# Altium schematic sheet УШЯИ.687245.044Э3_1.SchDoc
size 420 x 297 mm; SheetNumber: 1; SheetTotal: 2
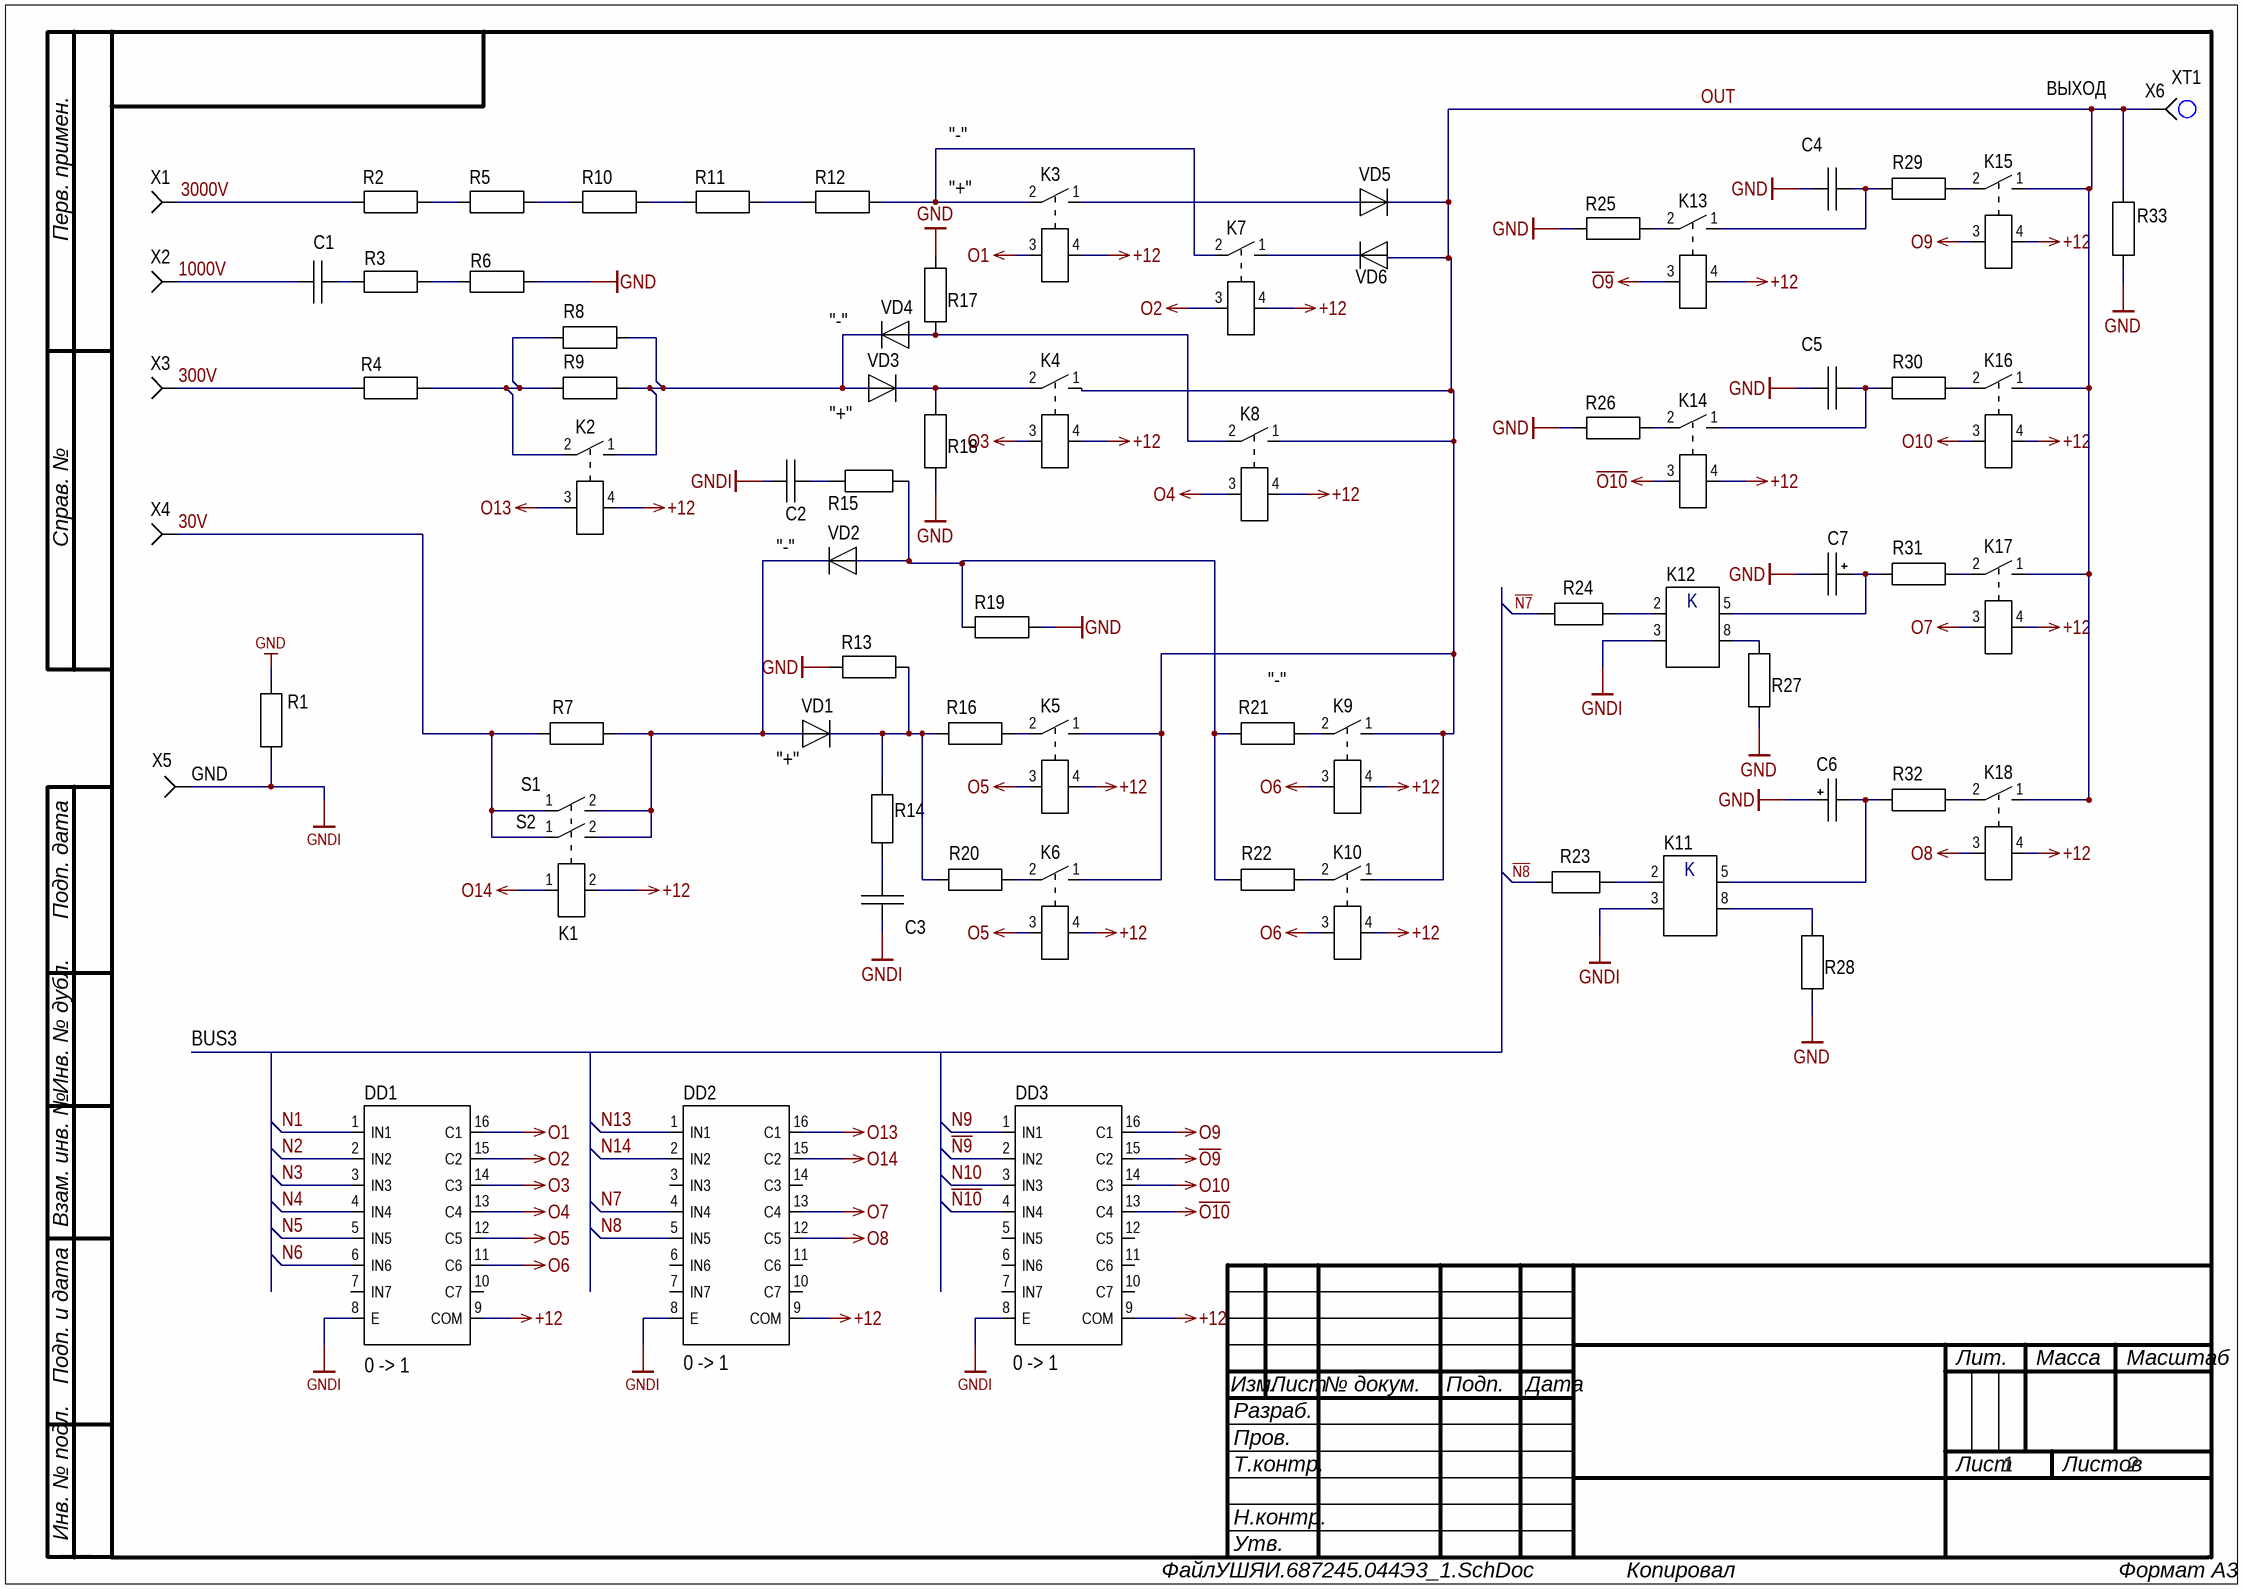
[diagram p0: УШЯИ.687245.044Э3_1.SchDoc]

## Parts
C1  К73-14М-4 кВ-0,033 мкФ +-10%  [К73-14М-4 кВ-D18]  (value not drawn)
C2  К73-17-250 В-0,47 мкФ +-20%  [К73-17-А20]  (value not drawn)
C3  К73-17-250 В-0,47 мкФ +-20%  [К73-17-А20]  (value not drawn)
C4  К73-14М-4 кВ-0,1 мкФ +-10%  [К73-14М-4 кВ-D28]  (value not drawn)
C5  К73-14М-4 кВ-0,1 мкФ +-10%  [К73-14М-4 кВ-D28]  (value not drawn)
C6  LGG2G331MELB30  [CAP TH ALUM ELEC D30.00mm S10.00mm H30.00mm]  (value not drawn)
C7  LGG2G331MELB30  [CAP TH ALUM ELEC D30.00mm S10.00mm H30.00mm]  (value not drawn)
DD1  ULQ2003AD  [16-SOIC]  (value not drawn)
DD2  ULQ2003AD  [16-SOIC]  (value not drawn)
DD3  ULQ2003AD  [16-SOIC]  (value not drawn)
K1  УШЯИ.685442.092vs2Rel  [УШЯИ.685442.092vs2Rel]  (value not drawn)
K2  DAR71210TU  [DAR71210TU]  (value not drawn)
K3  DAR71210TU  [DAR71210TU]  (value not drawn)
K4  DAR71210TU  [DAR71210TU]  (value not drawn)
K5  DAR71210TU  [DAR71210TU]  (value not drawn)
K6  DAR71210TU  [DAR71210TU]  (value not drawn)
K7  DAR71210TU  [DAR71210TU]  (value not drawn)
K8  DAR71210TU  [DAR71210TU]  (value not drawn)
K9  DAR71210TU  [DAR71210TU]  (value not drawn)
K10  DAR71210TU  [DAR71210TU]  (value not drawn)
K11  TLP3549F  [8-DIP]  (value not drawn)
K12  TLP3549F  [8-DIP]  (value not drawn)
K13  DAR71210TU  [DAR71210TU]  (value not drawn)
K14  DAR71210TU  [DAR71210TU]  (value not drawn)
K15  DAR71210TU  [DAR71210TU]  (value not drawn)
K16  DAR71210TU  [DAR71210TU]  (value not drawn)
K17  DAR71210TU  [DAR71210TU]  (value not drawn)
K18  DAR71210TU  [DAR71210TU]  (value not drawn)
R1  С2-33Н-0,5-270 Ом +-5%  [С2-33Н-0,5АИ (140.02.0203.00.00)]  (value not drawn)
R2  С2-33-2-1,2 кОм +-5%  [С2-33-2-NC]  (value not drawn)
R3  С2-33Н-1-10 кОм +-5%  [С2-33Н-1АИ (140.02.0204.00.00)]  (value not drawn)
R4  С2-33Н-1-15 Ом +-5%  [С2-33Н-1АИ-1PIN]  (value not drawn)
R5  С2-33-2-1,2 кОм +-5%  [С2-33-2-NC]  (value not drawn)
R6  С2-33Н-1-10 кОм +-5%  [С2-33Н-1АИ (140.02.0204.00.00)]  (value not drawn)
R7  С2-33-2-15 Ом +-5%  [С2-33-2-1PIN]  (value not drawn)
R8  С2-33-2-300 Ом +-5%  [С2-33-2 (140.02.0206.00.00)]  (value not drawn)
R9  С2-33-2-300 Ом +-5%  [С2-33-2 (140.02.0206.00.00)]  (value not drawn)
R10  С2-33-2-1,2 кОм +-5%  [С2-33-2-NC]  (value not drawn)
R11  С2-33-2-1,2 кОм +-5%  [С2-33-2-NC]  (value not drawn)
R12  С2-33-2-1,2 кОм +-5%  [С2-33-2-NC]  (value not drawn)
R13  С2-33-2-15 кОм +-5%  [С2-33-2-2PIN]  (value not drawn)
R14  1206-10 Ом+-5%  [1206]  (value not drawn)
R15  1206-10 Ом+-5%  [1206]  (value not drawn)
R16  С2-33Н-0,5-3 Ом +-5%  [С2-33Н-0,5АИ-1PIN]  (value not drawn)
R17  С2-33-2-470 кОм +-5%  [С2-33-2-1PIN]  (value not drawn)
R18  С2-33-2-470 кОм +-5%  [С2-33-2-1PIN]  (value not drawn)
R19  С2-33-2-15 кОм +-5%  [С2-33-2-2PIN]  (value not drawn)
R20  С2-33Н-0,5-3 Ом +-5%  [С2-33Н-0,5АИ-1PIN]  (value not drawn)
R21  С2-33Н-0,5-3 Ом +-5%  [С2-33Н-0,5АИ-1PIN]  (value not drawn)
R22  С2-33Н-0,5-3 Ом +-5%  [С2-33Н-0,5АИ-1PIN]  (value not drawn)
R23  1206-470 Ом+-5%  [1206]  (value not drawn)
R24  1206-470 Ом+-5%  [1206]  (value not drawn)
R25  С2-33Н-1-1 МОм +-5%  [С2-33Н-1АИ-1PIN]  (value not drawn)
R26  С2-33Н-1-1 МОм +-5%  [С2-33Н-1АИ-1PIN]  (value not drawn)
R27  С2-33-2-1,2 кОм +-5%  [С2-33-2-2PIN]  (value not drawn)
R28  С2-33-2-1,2 кОм +-5%  [С2-33-2-2PIN]  (value not drawn)
R29  С2-33-2-3,3 кОм +-5%  [С2-33-2-1PIN]  (value not drawn)
R30  С2-33-2-3,3 кОм +-5%  [С2-33-2-1PIN]  (value not drawn)
R31  С2-33Н-1-1 кОм +-5%  [С2-33Н-1АИ-1PIN]  (value not drawn)
R32  С2-33Н-1-1 кОм +-5%  [С2-33Н-1АИ-1PIN]  (value not drawn)
R33  Р1-32-1-18 МОм +-5%  [R1-32-1_(140.0210)]  (value not drawn)
S1  МКА-50202  (value not drawn)
S2  МКА-50202  (value not drawn)
VD1  20ETF08/IR  [TO-220]  (value not drawn)
VD2  20ETF08/IR  [TO-220]  (value not drawn)
VD3  BY255/Taw  [DO-201-NC]  (value not drawn)
VD4  BY255/Taw  [DO-201-NC]  (value not drawn)
VD5  HVM8  [HVM8]  (value not drawn)
VD6  HVM8  [HVM8]  (value not drawn)
X1  TR-1,25-4  (value not drawn)
X2  TR-1,25-4  (value not drawn)
X3  TR-1,25-4  (value not drawn)
X4  TR-1,25-4  (value not drawn)
X5  TR-1,25-4  (value not drawn)
X6  TR-1,25-4  (value not drawn)
XT1  УШЯИ.685631.123  (value not drawn)

## Nets
+12: DD1.9(COM) DD2.9(COM) DD3.9(COM) K1.2(COIL_2) K2.4(COIL_1) K3.4(COIL_1) K4.4(COIL_1) K5.4(COIL_1) K6.4(COIL_1) K7.4(COIL_1) K8.4(COIL_1) K9.4(COIL_1) K10.4(COIL_1) K13.4(COIL_1) K14.4(COIL_1) K15.4(COIL_1) K16.4(COIL_1) K17.4(COIL_1) K18.4(COIL_1)
~{O9}: DD3.15(C2) K13.3(COIL_2)
~{O10}: DD3.13(C4) K14.3(COIL_2)
GND: C4.1 C5.1 C6.1 C7.2 R1.2 R6.2 R13.1 R17.1 R18.1 R19.2 R25.1 R26.1 R27.2 R28.2 R33.1
GNDI: C2.2 C3.2 DD1.8(E) DD2.8(E) DD3.8(E) K11.3(KATHODE) K12.3(KATHODE) R1.1 X5.1
O1: DD1.16(C1) K3.3(COIL_2)
O2: DD1.15(C2) K7.3(COIL_2)
O3: DD1.14(C3) K4.3(COIL_2)
O4: DD1.13(C4) K8.3(COIL_2)
O5: DD1.12(C5) K5.3(COIL_2) K6.3(COIL_2)
O6: DD1.11(C6) K9.3(COIL_2) K10.3(COIL_2)
O7: DD2.13(C4) K17.3(COIL_2)
O8: DD2.12(C5) K18.3(COIL_2)
O9: DD3.16(C1) K15.3(COIL_2)
O10: DD3.14(C3) K16.3(COIL_2)
O13: DD2.16(C1) K2.3(COIL_2)
O14: DD2.15(C2) K1.1(COIL_1)
30V: R7.1 S1.1(NO) S2.1(NO) X4.1
300V: R4.1 X3.1
1000V: C1.1 X2.1
3000V: R2.1 X1.1
~{N7}: R24.1
~{N8}: R23.1
~{N9}: DD3.2(IN2)
~{N10}: DD3.4(IN4)
N1: DD1.1(IN1)
N2: DD1.2(IN2)
N3: DD1.3(IN3)
N4: DD1.4(IN4)
N5: DD1.5(IN5)
N6: DD1.6(IN6)
N7: DD2.4(IN4)
N8: DD2.5(IN5)
N9: DD3.1(IN1)
N10: DD3.3(IN3)
N13: DD2.1(IN1)
N14: DD2.2(IN2)
OUT: K4.1(COM) K5.1(COM) K6.1(COM) K8.1(COM) K9.1(COM) K10.1(COM) K15.1(COM) K16.1(COM) K17.1(COM) K18.1(COM) R33.2 VD5.2 VD6.1 X6.1
NetC1_2: C1.2 R3.1
NetC2_1: C2.1 R15.2
NetC3_1: C3.1 R14.2
NetC4_2: C4.2 K13.1(COM) R29.2
NetC5_2: C5.2 K14.1(COM) R30.2
NetC6_2: C6.2 K11.5(DRAIN) R32.2
NetC7_1: C7.1 K12.5(DRAIN) R31.2
NetK2_1: K2.1(COM) R8.2 R9.2 VD3.1 VD4.2
NetK2_2: K2.2(NO) R4.2 R8.1 R9.1
NetK3_1: K3.1(COM) VD5.1
NetK3_2: K3.2(NO) K7.2(NO) R12.2
NetK4_2: K4.2(NO) R18.2 VD3.2
NetK5_2: K5.2(NO) R16.2
NetK6_2: K6.2(NO) R20.1
NetK7_1: K7.1(COM) VD6.2
NetK8_2: K8.2(NO) R17.2 VD4.1
NetK9_2: K9.2(NO) R21.2
NetK10_2: K10.2(NO) R22.1
NetK11_2: K11.2(ANOD) R23.2
NetK11_8: K11.8(DRAIN) R28.1
NetK12_2: K12.2(ANOD) R24.2
NetK12_8: K12.8(DRAIN) R27.1
NetK13_2: K13.2(NO) R25.2
NetK14_2: K14.2(NO) R26.2
NetK15_2: K15.2(NO) R29.1
NetK16_2: K16.2(NO) R30.1
NetK17_2: K17.2(NO) R31.1
NetK18_2: K18.2(NO) R32.1
NetR2_2: R2.2 R5.1
NetR3_2: R3.2 R6.1
NetR5_2: R5.2 R10.1
NetR7_2: R7.2 S1.2(COM) S2.2(COM) VD1.3(Anode) VD2.1(Cathode)
NetR10_2: R10.2 R11.1
NetR11_2: R11.2 R12.1
NetR13_2: R13.2 R14.1 R16.1 R20.2 VD1.1(Cathode)
NetR15_1: R15.1 R19.1 R21.1 R22.2 VD2.3(Anode)

Not connected (* = marked no-connect by the designer): DD1 7(IN7) 10(C7); DD2 3(IN3) 6(IN6) 7(IN7) 10(C7) 11(C6) 14(C3); DD3 5(IN5) 6(IN6) 7(IN7) 10(C7) 11(C6) 12(C5)

## Notes on the sheet
- ВЫХОД
- "-"
- "+"
- (near VD4) "-"
- (near VD3) "+"
- (near VD2) "-"
- (near X5) GND
- (near VD1) "+"
- BUS3
- (near DD1) 0 -> 1
- (near DD2) 0 -> 1
- (near DD3) 0 -> 1
- Перв. примен.
- Справ. №
- Подп. дата
- Инв. № дубл.
- Взам. инв. №
- Подп. и дата
- Изм.
- Разраб.
- Лист
- № докум.
- Подп.
- Дата
- Лит.
- Масса
- Масштаб
- Пров.
- Т.контр.
- Листов
- Инв. № подл.
- Н.контр.
- Утв.
- ALTIUM GOSTBOM2.0 KEV
- Файл:
- Копировал
- Формат А3
- (in symbol TLP3549F) K

## Library data of the parts
C6 C7 = LGG2G331MELB30: 330uF, 400V
DD1-DD3 = ULQ2003AD: High-Current Darlington Transistor Arrays, 16-SOIC
K2-K10 K13-K18 = DAR71210TU: HIGH VOLTAGE RELAYS - 10KV
R1 = С2-33Н-0,5-270 Ом +-5%: Резисторы постоянные непроволочные общего применения С2-33Н АИ, производитель "АО"НПО"ЭРКОН"; Номинальная мощность рассеяния: 0,5 Вт; Диапазон значений номинальных сопротивлений: от 1 Ом до 5,11 МОм; Ряд сопротивлений: Е24, Е96; Категории качества: «ОТК»; ТУ: ОЖО.467.173 ТУ; Value: 430 Ом
R2 R5 R10-R12 R27 R28 = С2-33-2-1,2 кОм +-5%: Резисторы постоянные непроволочные общего применения С2-33, производитель "АО"НПО"ЭРКОН"; Номинальная мощность рассеяния: 1 Вт; Диапазон значений номинальных сопротивлений: от 1 Ом до 22 МОм; Ряд сопротивлений: Е24, Е96; Категории качества: «ОТК»; ТУ: ОЖО.467.173 ТУ; Value: *
R3 R6 = С2-33Н-1-10 кОм +-5%: Резисторы постоянные непроволочные общего применения С2-33Н АИ, производитель "АО"НПО"ЭРКОН"; Номинальная мощность рассеяния: 1 Вт; Диапазон значений номинальных сопротивлений: от 1 Ом до 22 МОм; Ряд сопротивлений: Е24, Е96; Категории качества: «ОТК»; ТУ: ОЖО.467.173 ТУ; Value: *
R4 = С2-33Н-1-15 Ом +-5%: Резисторы постоянные непроволочные общего применения С2-33Н АИ, производитель "АО"НПО"ЭРКОН"; Номинальная мощность рассеяния: 1 Вт; Диапазон значений номинальных сопротивлений: от 1 Ом до 22 МОм; Ряд сопротивлений: Е24, Е96; Категории качества: «ОТК»; ТУ: ОЖО.467.173 ТУ; Value: *
R7 = С2-33-2-15 Ом +-5%: Резисторы постоянные непроволочные общего применения С2-33, производитель "АО"НПО"ЭРКОН"; Номинальная мощность рассеяния: 1 Вт; Диапазон значений номинальных сопротивлений: от 1 Ом до 22 МОм; Ряд сопротивлений: Е24, Е96; Категории качества: «ОТК»; ТУ: ОЖО.467.173 ТУ; Value: *
R8 R9 = С2-33-2-300 Ом +-5%: Резисторы постоянные непроволочные общего применения С2-33, производитель "АО"НПО"ЭРКОН"; Номинальная мощность рассеяния: 1 Вт; Диапазон значений номинальных сопротивлений: от 1 Ом до 22 МОм; Ряд сопротивлений: Е24, Е96; Категории качества: «ОТК»; ТУ: ОЖО.467.173 ТУ; Value: *
R13 R19 = С2-33-2-15 кОм +-5%: Резисторы постоянные непроволочные общего применения С2-33, производитель "АО"НПО"ЭРКОН"; Номинальная мощность рассеяния: 1 Вт; Диапазон значений номинальных сопротивлений: от 1 Ом до 22 МОм; Ряд сопротивлений: Е24, Е96; Категории качества: «ОТК»; ТУ: ОЖО.467.173 ТУ; Value: *
R14 R15 = 1206-10 Ом+-5%: Value: 10 Ом; ModelPrint: 1206
R16 R20-R22 = С2-33Н-0,5-3 Ом +-5%: Резисторы постоянные непроволочные общего применения С2-33Н АИ, производитель "АО"НПО"ЭРКОН"; Value: 3 Ом; Номинальная мощность рассеяния: 0,5 Вт; Диапазон значений номинальных сопротивлений: от 1 Ом до 5,11 МОм; Ряд сопротивлений: Е24, Е96; Категории качества: «ОТК»; ТУ: ОЖО.467.173 ТУ
R17 R18 = С2-33-2-470 кОм +-5%: Резисторы постоянные непроволочные общего применения С2-33, производитель "АО"НПО"ЭРКОН"; Номинальная мощность рассеяния: 1 Вт; Диапазон значений номинальных сопротивлений: от 1 Ом до 22 МОм; Ряд сопротивлений: Е24, Е96; Категории качества: «ОТК»; ТУ: ОЖО.467.173 ТУ; Value: *
R23 R24 = 1206-470 Ом+-5%: Value: 470 Ом; ModelPrint: 1206
R25 R26 = С2-33Н-1-1 МОм +-5%: Резисторы постоянные непроволочные общего применения С2-33Н АИ, производитель "АО"НПО"ЭРКОН"; Номинальная мощность рассеяния: 1 Вт; Диапазон значений номинальных сопротивлений: от 1 Ом до 22 МОм; Ряд сопротивлений: Е24, Е96; Категории качества: «ОТК»; ТУ: ОЖО.467.173 ТУ; Value: *
R29 R30 = С2-33-2-3,3 кОм +-5%: Резисторы постоянные непроволочные общего применения С2-33, производитель "АО"НПО"ЭРКОН"; Номинальная мощность рассеяния: 1 Вт; Диапазон значений номинальных сопротивлений: от 1 Ом до 22 МОм; Ряд сопротивлений: Е24, Е96; Категории качества: «ОТК»; ТУ: ОЖО.467.173 ТУ; Value: *
R31 R32 = С2-33Н-1-1 кОм +-5%: Резисторы постоянные непроволочные общего применения С2-33Н АИ, производитель "АО"НПО"ЭРКОН"; Номинальная мощность рассеяния: 1 Вт; Диапазон значений номинальных сопротивлений: от 1 Ом до 22 МОм; Ряд сопротивлений: Е24, Е96; Категории качества: «ОТК»; ТУ: ОЖО.467.173 ТУ; Value: *
R33 = Р1-32-1-18 МОм +-5%: Резистор постоянный непроволочный высокоомный Р1-32, производитель "АО"НПО"ЭРКОН"; Номинальная мощность рассеяния: 1 Вт; Диапазон значений номинальных сопротивлений: от 1 МОм до 1000 МОм; Ряд сопротивлений: Е24; Категории качества: «ОТК»; ТУ: АБШК.434110.018 ТУ; Допускаемое отклонение сопротивления: ±5%; ±10%
VD1 VD2 = 20ETF08/IR: Диод 20ETF08/IR; Value: *
VD3 VD4 = BY255/Taw: Выпрямитель BY255/Taw; Value: *
VD5 VD6 = HVM8: Выпрямитель HVM8; Value: *
X1-X6 = TR-1,25-4: Клемма TR-1,25-4; System: Connector
C1 = К73-14М-4 кВ-0,033 мкФ +-10%: Value: *
C2 C3 = К73-17-250 В-0,47 мкФ +-20%: Value: *
C4 C5 = К73-14М-4 кВ-0,1 мкФ +-10%: Value: *